# Altium project PCB_Project.PrjPcb
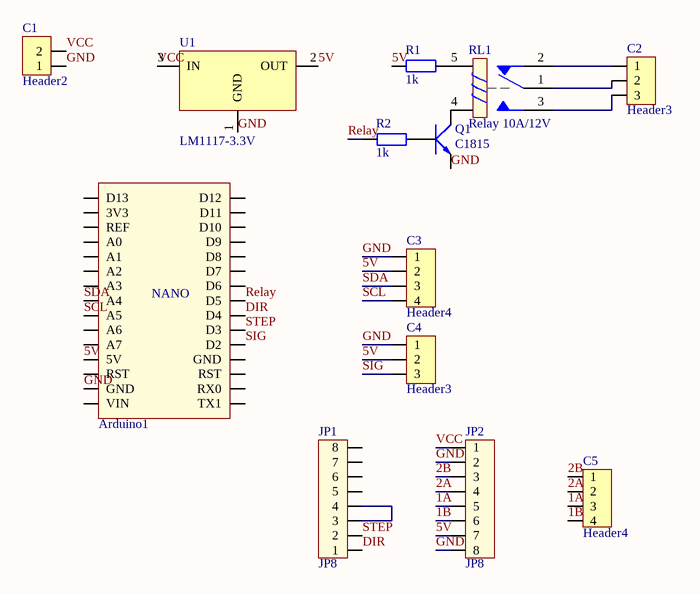
[diagram p0: Sheet1.SchDoc]
1 sheet, 13 parts. Net scope: global (net labels, ports and power ports of the same name join across sheets).
Board file: PCB1.PcbDoc

## Sheet Sheet1.SchDoc
size A

### Parts
Arduino1  Arduino Nano  [Arduino Nano]  (value not drawn)
C1  Header2  [HDR2]
C2  Header3  [Header3]
C3  Header4  [HDR4]
C4  Header3  [Header3]
C5  Header4  [HDR4]
JP1  JP8  [Header8]
JP2  JP8  [Header8]
Q1  C1815  [QTO-92]
R1  1k  [R1/2W]
R2  1k  [R1/2W]
RL1  Relay 10A/12V  [RL_SPDT_10A]
U1  LM1117-3.3V  [SOT223]

### Nets
1A: C5.3 JP2.5
1B: C5.4 JP2.6
2A: C5.2 JP2.4
2B: C5.1 JP2.3
5V: Arduino1.5V C3.2 C4.2 JP2.7 R1.1 U1.2(OUT)
DIR: Arduino1.D4 JP1.1
GND: Arduino1.GND C1.1 C3.1 C4.1 JP2.2 JP2.8 Q1.1(E) U1.1(GND)
Relay: Arduino1.D5 R2.1
SCL: Arduino1.A5 C3.4
SDA: Arduino1.A4 C3.3
SIG: Arduino1.D2 C4.3
STEP: Arduino1.D3 JP1.2
VCC: C1.2 JP2.1 U1.3(IN)
NetC2_1: C2.1 RL1.2
NetC2_2: C2.2 RL1.1
NetC2_3: C2.3 RL1.3
NetJP1_3: JP1.3 JP1.4
NetQ1_2: Q1.2(C) RL1.4
NetQ1_3: Q1.3(B) R2.2
NetR1_2: R1.2 RL1.5

Not connected (* = marked no-connect by the designer): Arduino1 3V3 A0 A1 A2 A3 A6 A7 D6 D7 D8 D9 D10 D11 D12 D13 REF RST RX0 TX1 VIN; JP1 5 6 7 8

### Notes on the sheet
- (in symbol Arduino Nano) NANO

### Library data of the parts
Arduino1 = Arduino Nano: Value: Cau 1A
C1 = Header2: Header IDC, 2 x 1 Pin Vertical 2.54mm Pitch (Non-Boxed, Male); Manufacturer: W¨¹rth Elektronik eiSos GmbH; partNo: 613002143121; ComponentLink1 Description: Manufacturer; ComponentLink2 Description: Datasheet; NoPins: 02; Created Date: 29 March 2013; ComponentLink1URL: http://www.we-online.com; ComponentLink2URL: http://katalog.we-online.de/em/datasheet/6130xx143121.pdf; Created by: Karrer Zheng
C2 C4 = Header3: Header IDC, 3 x 1 Pin Vertical 2.54mm Pitch (Non-Boxed, Male); Manufacturer: W¨¹rth Elektronik eiSos GmbH; partNo: 613002143121; ComponentLink1 Description: Manufacturer; ComponentLink2 Description: Datasheet; NoPins: 02; Created Date: 29 March 2013; ComponentLink1URL: http://www.we-online.com; ComponentLink2URL: http://katalog.we-online.de/em/datasheet/6130xx143121.pdf; Created by: Karrer Zheng
C3 C5 = Header4: Header IDC, 4 x 1 Pin Vertical 2.54mm Pitch (Non-Boxed, Male); Manufacturer: W¨¹rth Elektronik eiSos GmbH; partNo: 613002143121; ComponentLink1 Description: Manufacturer; ComponentLink2 Description: Datasheet; NoPins: 02; Created Date: 29 March 2013; ComponentLink1URL: http://www.we-online.com; ComponentLink2URL: http://katalog.we-online.de/em/datasheet/6130xx143121.pdf; Created by: Karrer Zheng
JP1 JP2 = Header8: Connector 8; Value: Connector 8
Q1 = C1815: NPN 600mW, ECB; Value: C1815
R1 R2 = R1/4W: Resistor 1/4W; Value: R1/4W - 1K
RL1 = Relay 1: Relay SPDT,10A - 12VDC 5 Pin; Value: Relay SPDT, 10A, 12V
U1 = LM1117: 800mA Low-Dropout Linear Regulator; Creator: Nguyen Ba Bien; Website: http://group3i.net